# EAGLE design M783 (EAGLE 6.6.0)
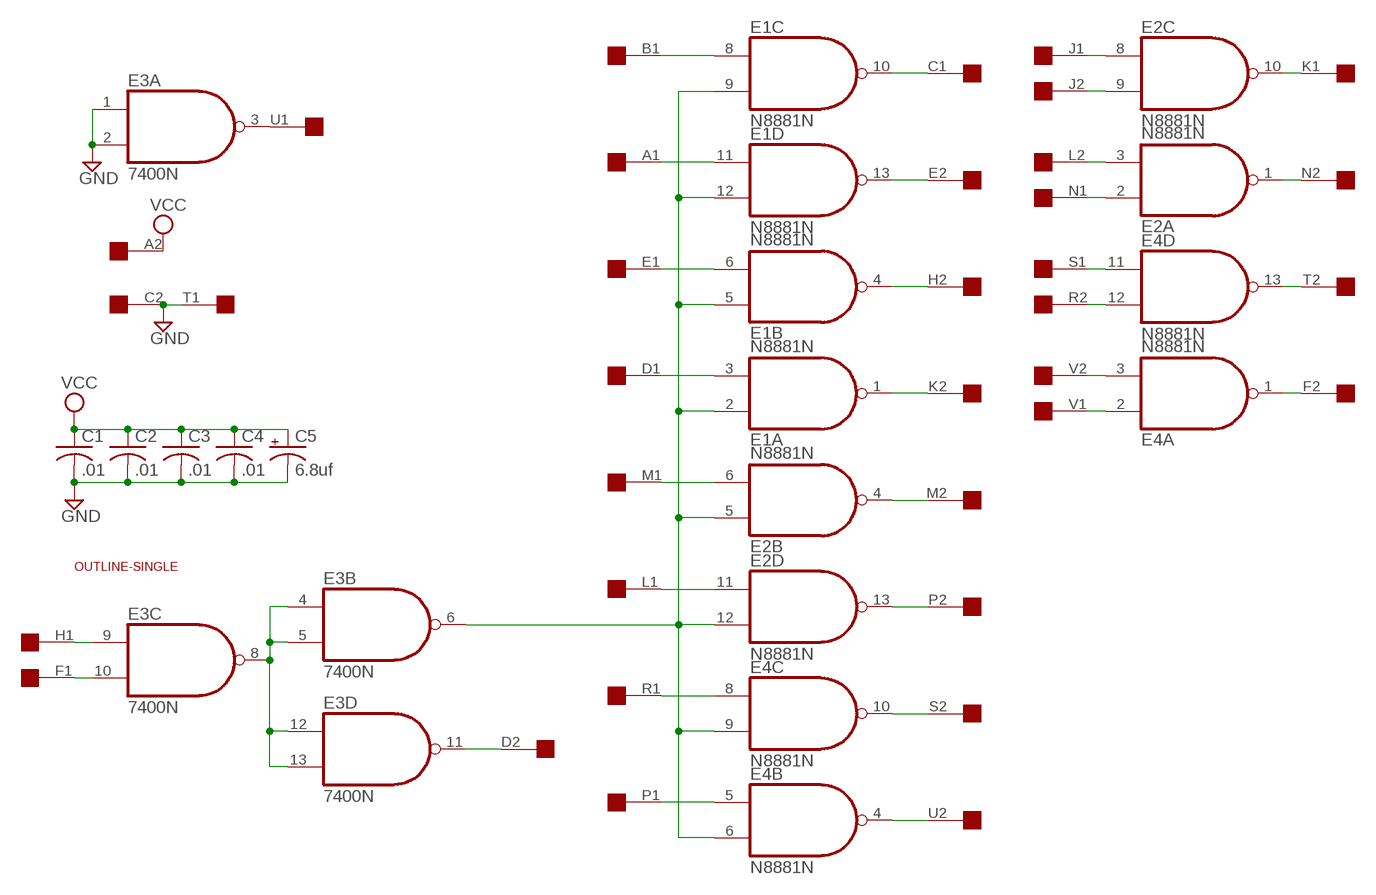
[diagram p0: schematic, sheet 1]

## Parts
C1  .01  C-US050-025X075  [C050-025X075]
C2  .01  C-US050-025X075  [C050-025X075]
C3  .01  C-US050-025X075  [C050-025X075]
C4  .01  C-US050-025X075  [C050-025X075]
C5  6.8uf  CPOL-USE15-5AXIAL  [E15-5]
E1  N8881N  [DIL14]
E2  N8881N  [DIL14]
E3  7400N  [DIL14]
E4  N8881N  [DIL14]
U$1  SINGLE  [EDGE-CON2]
U$2  OUTLINE-SINGLE  [SINGLE]

## Nets
GND: C1.2 C2.2 C3.2 C4.2 C5.- E3.1(A:I0) E3.2(A:I1) U$1.C2 U$1.T1
N$1: E3.3(A:O) U$1.U1
N$2: E1.2(A:I0) E1.5(B:I0) E1.9(C:I1) E1.12(D:I1) E2.5(B:I0) E2.12(D:I1) E3.6(B:O) E4.6(B:I1) E4.9(C:I1)
N$3: E2.4(B:O) U$1.M2
N$4: E2.13(D:O) U$1.P2
N$5: E4.5(B:I0) U$1.P1
N$6: E4.8(C:I0) U$1.R1
N$7: E4.10(C:O) U$1.S2
N$8: E2.11(D:I0) U$1.L1
N$9: E4.4(B:O) U$1.U2
N$10: E2.6(B:I1) U$1.M1
N$11: E1.10(C:O) U$1.C1
N$12: E1.8(C:I0) U$1.B1
N$13: E1.13(D:O) U$1.E2
N$14: E1.11(D:I0) U$1.A1
N$15: E1.4(B:O) U$1.H2
N$16: E1.6(B:I1) U$1.E1
N$17: E1.1(A:O) U$1.K2
N$18: E1.3(A:I1) U$1.D1
N$19: E3.11(D:O) U$1.D2
N$20: E4.1(A:O) U$1.F2
N$21: E4.13(D:O) U$1.T2
N$22: E2.1(A:O) U$1.N2
N$23: E2.10(C:O) U$1.K1
N$24: E2.8(C:I0) U$1.J1
N$25: E2.9(C:I1) U$1.J2
N$26: E2.3(A:I1) U$1.L2
N$27: E2.2(A:I0) U$1.N1
N$28: E4.11(D:I0) U$1.S1
N$29: E4.12(D:I1) U$1.R2
N$30: E3.4(B:I0) E3.5(B:I1) E3.8(C:O) E3.12(D:I0) E3.13(D:I1)
N$31: E3.9(C:I0) U$1.H1
N$32: E3.10(C:I1) U$1.F1
N$33: E4.3(A:I1) U$1.V2
N$34: E4.2(A:I0) U$1.V1
VCC: C1.1 C2.1 C3.1 C4.1 C5.+ U$1.A2
Unconnected: U$1.B2

## Power pins joined to a net without a drawn wire
GND: E1.7(P:GND) E2.7(P:GND) E3.7(P:GND) E4.7(P:GND)
VCC: E1.14(P:VCC) E2.14(P:VCC) E3.14(P:VCC) E4.14(P:VCC)

## Library data of the parts
C1-C4 = rcl:C-US: CAPACITOR, American symbol
C5 = rcl:CPOL-US: POLARIZED CAPACITOR, American symbol
E1 E2 E4 = dec-con:N8881: Quad 2-input NAND gate, open collector
E3 = 74xx-us:74*00: Quad 2-input NAND gate
U$1 = dec-con:SINGLE: Single-Height DEC board
U$2 = dec-con:OUTLINE-*: Board outlines for DEC boards.

## Board
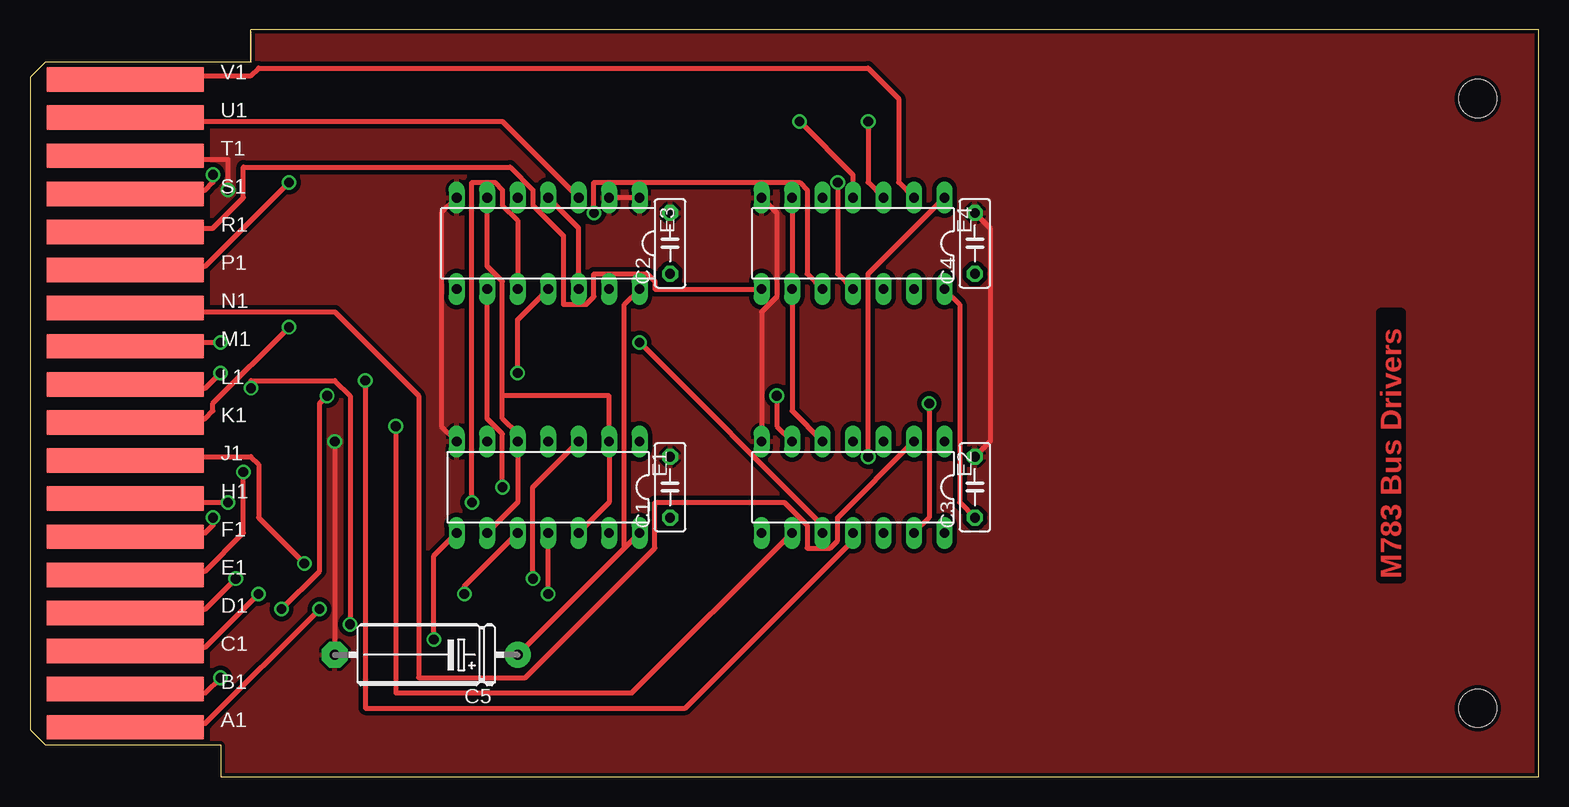
[diagram p1: board, top side]
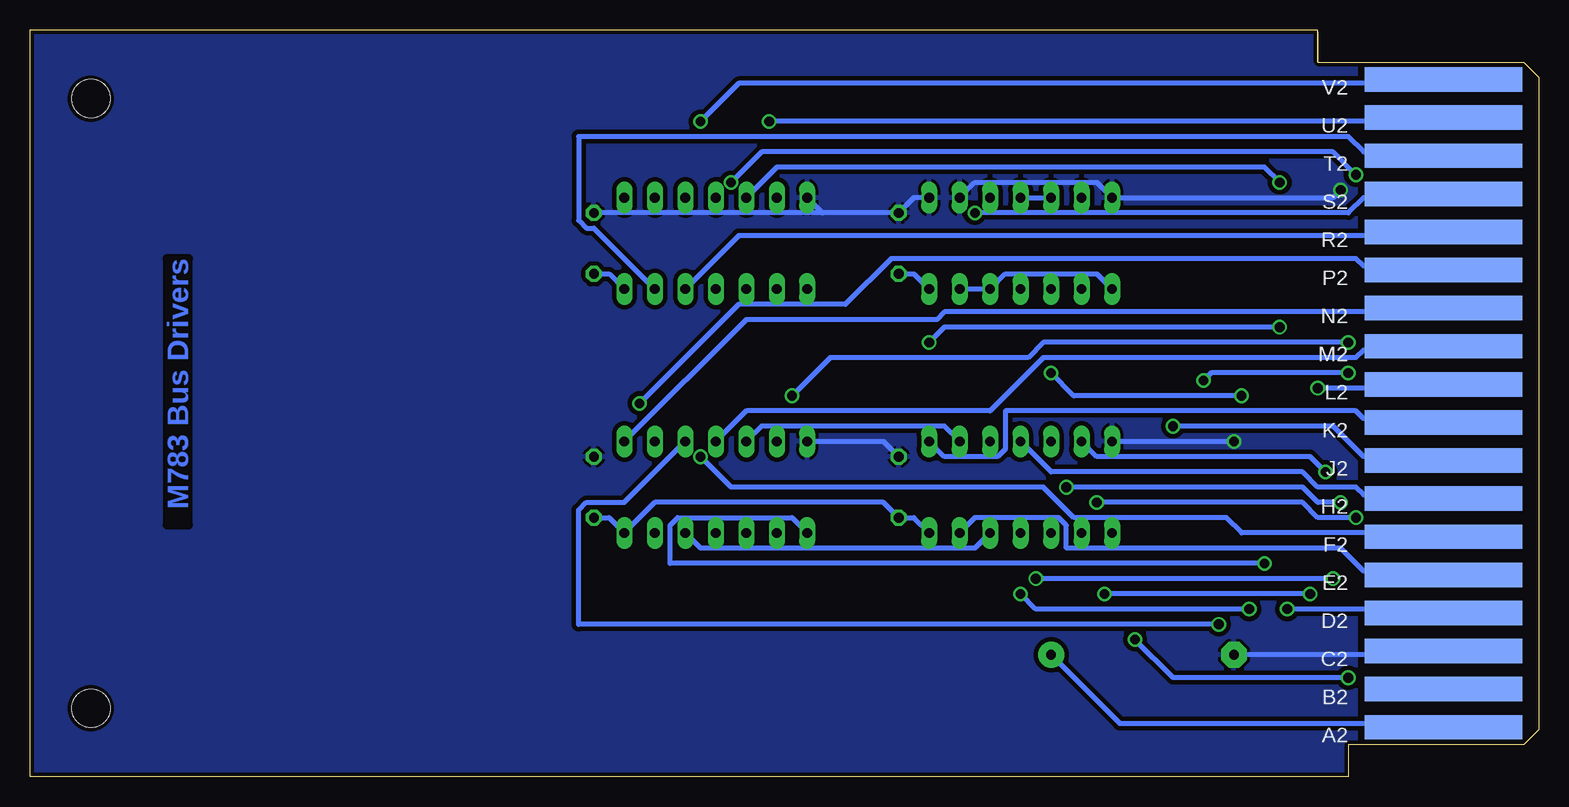
[diagram p2: board, bottom side, seen from below]

Size 125.73 x 62.23 mm. Coordinates in mm from the lower left corner, seen from the top.
Copper layers (1+16): Top 0.035mm / dielectric 1.5mm / Bottom 0.035mm
Design rules "16mils": minimum track width 16mil, minimum drill 32mil, track to track 15mil, track to pad 10mil, pad to pad 10mil, via to via 10mil, smd to smd 10mil, copper to edge 13mil, drill to drill 10mil, minimum pad ring 10mil, minimum via ring 8mil, stop-mask expansion 0mil, vias tented up to drill 0mil, thermal gap 10mil

### Footprints (pad centres in the part's own frame; a part is rotated, then mirrored left to right if it is on the bottom)
C050-025X075 = drill 0.813 octagon: 1 -2.54,0; 2 2.54,0
E15-5 = drill 0.813 pad 2.159: + -7.62,0 | drill 0.813 pad 2.159 octagon: - 7.62,0
DIL14 = drill 0.813 long: 1 -7.62,-3.81; 2 -5.08,-3.81; 3 -2.54,-3.81; 4 0,-3.81; 5 2.54,-3.81; 6 5.08,-3.81; 7 7.62,-3.81; 8 7.62,3.81; 9 5.08,3.81; 10 2.54,3.81; 11 0,3.81; 12 -2.54,3.81; 13 -5.08,3.81; 14 -7.62,3.81
EDGE-CON2 = smd 13.106 x 2.032: A1 7.938,4.128; B1 7.938,7.303; C1 7.938,10.477; D1 7.938,13.652; E1 7.938,16.828; F1 7.938,20.003; H1 7.938,23.177; J1 7.938,26.352; K1 7.938,29.527; L1 7.938,32.703; M1 7.938,35.877; N1 7.938,39.053; P1 7.938,42.227; R1 7.938,45.403; S1 7.938,48.578; T1 7.938,51.752; U1 7.938,54.928; V1 7.938,58.102 | smd 13.106 x 2.032 bottom: A2 7.938,4.128; B2 7.938,7.303; C2 7.938,10.477; D2 7.938,13.652; E2 7.938,16.828; F2 7.938,20.003; H2 7.938,23.177; J2 7.938,26.352; K2 7.938,29.527; L2 7.938,32.703; M2 7.938,35.877; N2 7.938,39.053; P2 7.938,42.227; R2 7.938,45.403; S2 7.938,48.578; T2 7.938,51.752; U2 7.938,54.928; V2 7.938,58.102
SINGLE = hole 3.175: 120.65,56.515; 120.65,5.715

### Placement (x,y rotation side)
C1  53.34,24.13 90 top
C2  53.34,44.45 90 top
C3  78.74,24.13 90 top
C4  78.74,44.45 90 top
C5  33.02,10.16 180 top
E1  43.18,24.13 180 top
E2  68.58,24.13 180 top
E3  43.18,44.45 180 top
E4  68.58,44.45 180 top
U$1  0,0 0 top
U$2  0,0 0 top

### Tracks (layer width: path | path; a pad name or v marks a point on that pad's centre or on a via)
GND  (via drill 0.81)
  Top 0.406: E1.7 34.29,29.21 34.29,46.99 E3.7 | C3.2 80.01,27.94 80.01,45.72 C4.2 | E3.1 E3.2 | E2.7 60.96,38.73 62.23,40.01 62.23,46.99 E4.7 | v16.51,48.9 16.51,51.44 8.26,51.44 U$1.T1 | v25.4,27.94 C5.-
  Bottom 0.406: C5.- 8.26,10.16 U$1.C2 | C1.2 54.61,27.94 E2.7 | E3.1 52.07,48.26 C2.2 59.69,46.99 | 59.69,46.99 E4.7 | 59.69,46.99 C4.2 | E3.2 46.99,49.53 36.83,49.53 E3.7 17.15,48.26 v16.51,48.9 | E1.7 v25.4,27.94
  pour Top (isolate 0.305): 15.24,62.23 125.73,62.23 125.73,0 15.24,0
  pour Bottom (isolate 0.305): 15.24,62.23 125.73,62.23 125.73,0 15.24,0
N$1
  Top 0.406: E3.3 39.37,54.61 8.26,54.61 U$1.U1
N$2
  Top 0.406: E1.9 40.64,22.86 E1.5 40.64,28.57 39.37,29.84 39.37,31.75 | E3.6 38.1,42.55 39.37,41.27 39.37,31.75 | E4.6 E4.9 63.5,30.48 E2.5 | E1.12 48.26,22.86 E1.2 48.26,31.75 39.37,31.75
  Bottom 0.406: E2.12 69.85,19.05 46.99,19.05 E1.12 | E2.5 64.77,29.21 49.53,29.21 E1.2
N$3
  Bottom 0.406: E2.4 66.04,30.48 45.72,30.48 41.28,34.92 15.24,34.92 14.61,35.56 8.26,35.56 U$1.M2
N$4  (via drill 0.81)
  Top 0.406: E2.13 74.93,21.59 v74.93,31.11
  Bottom 0.406: v74.93,31.11 66.68,39.37 57.79,39.37 53.98,43.18 15.24,43.18 14.61,42.55 8.26,42.55 U$1.P2
N$5  (via drill 0.81)
  Top 0.406: v21.59,49.53 14.61,42.55 8.26,42.55 U$1.P1
  Bottom 0.406: E4.5 63.5,50.8 22.86,50.8 v21.59,49.53
N$6
  Top 0.406: E4.8 52.07,40.64 52.07,41.27 51.44,41.91 46.99,41.91 46.99,40.01 46.36,39.37 44.45,39.37 44.45,45.09 41.91,47.62 41.91,48.9 40.01,50.8 17.78,50.8 17.78,48.26 15.24,45.72 8.26,45.72 U$1.R1
N$7  (via drill 0.81)
  Top 0.406: E4.10 64.77,41.91 64.77,48.9 64.14,49.53 46.99,49.53 v46.99,46.99
  Bottom 0.406: v46.99,46.99 15.88,46.99 14.61,48.26 8.26,48.26 U$1.S2
N$8  (via drill 0.81)
  Top 0.406: E2.11 68.58,19.68 54.61,5.71 27.94,5.71 v27.94,33.02 | v15.88,33.66 14.61,32.38 8.26,32.38 U$1.L1
  Bottom 0.406: v27.94,33.02 27.31,33.66 v15.88,33.66
N$9  (via drill 0.81)
  Top 0.406: E4.4 68.58,50.16 v64.14,54.61
  Bottom 0.406: v64.14,54.61 8.26,54.61 U$1.U2
N$10  (via drill 0.81)
  Top 0.406: E2.6 62.23,29.21 v62.23,31.75 | v15.88,36.2 8.26,36.2 U$1.M1
  Bottom 0.406: v62.23,31.75 59.06,34.92 42.55,34.92 41.28,36.2 v15.88,36.2
N$11  (via drill 0.81)
  Top 0.406: E1.10 36.2,15.88 v36.2,15.24 | v19.05,15.24 14.61,10.79 8.26,10.79 U$1.C1
  Bottom 0.406: v19.05,15.24 v36.2,15.24
N$12  (via drill 0.81)
  Top 0.406: E1.8 33.66,18.41 v33.66,11.43 | v15.88,8.26 14.61,6.99 8.26,6.99 U$1.B1
  Bottom 0.406: v33.66,11.43 30.48,8.26 v15.88,8.26
N$13
  Bottom 0.406: E1.13 46.99,21.59 40.01,21.59 39.37,20.95 39.37,19.05 16.51,19.05 14.61,17.14 8.26,17.14 U$1.E2
N$14  (via drill 0.81)
  Top 0.406: v43.18,15.24 E1.11 | v24.13,13.97 14.61,4.45 8.26,4.45 U$1.A1
  Bottom 0.406: v43.18,15.24 41.91,13.97 v24.13,13.97
N$15
  Bottom 0.406: E1.4 40.64,25.4 19.69,25.4 18.42,24.13 15.24,24.13 14.61,23.5 8.26,23.5 U$1.H2
N$16  (via drill 0.81)
  Top 0.406: v17.78,25.4 17.78,20.32 14.61,17.14 8.26,17.14 U$1.E1
  Bottom 0.406: E1.6 36.83,26.67 19.05,26.67 v17.78,25.4
N$17
  Bottom 0.406: E1.1 49.53,26.67 45.09,26.67 44.45,27.3 44.45,30.48 15.24,30.48 14.61,29.84 8.26,29.84 U$1.K2
N$18  (via drill 0.81)
  Top 0.406: E1.3 41.91,24.13 v41.91,16.51 | v17.15,16.51 14.61,13.97 8.26,13.97 U$1.D1
  Bottom 0.406: v17.15,16.51 v41.91,16.51
N$19  (via drill 0.81)
  Top 0.406: E3.11 40.64,38.1 v40.64,33.66 | v24.77,31.75 24.13,31.11 24.13,17.14 v20.96,13.97
  Bottom 0.406: v40.64,33.66 38.74,31.75 v24.77,31.75 | v20.96,13.97 8.26,13.97 U$1.D2
N$20  (via drill 0.81)
  Top 0.406: E4.1 69.85,41.91 v69.85,26.67
  Bottom 0.406: v69.85,26.67 67.31,24.13 41.28,24.13 38.74,21.59 26.04,21.59 24.77,20.32 8.26,20.32 U$1.F2
N$21
  Bottom 0.406: E4.13 78.74,45.72 79.38,45.72 80.01,46.35 80.01,53.34 15.88,53.34 14.61,52.07 8.26,52.07 U$1.T2
N$22
  Bottom 0.406: E2.1 66.04,38.1 50.17,38.1 49.53,38.73 8.26,38.73 U$1.N2
N$23  (via drill 0.81)
  Top 0.406: E2.10 66.04,20.95 v50.8,36.2 | v21.59,37.47 15.24,31.11 15.24,30.48 14.61,29.84 8.26,29.84 U$1.K1
  Bottom 0.406: v50.8,36.2 49.53,37.47 v21.59,37.47
N$24  (via drill 0.81)
  Top 0.406: v22.86,17.78 19.05,21.59 19.05,26.04 18.42,26.67 8.26,26.67 U$1.J1
  Bottom 0.406: E2.8 62.23,21.59 71.76,21.59 72.39,20.95 72.39,17.78 v22.86,17.78
N$25  (via drill 0.81)
  Top 0.406: E2.9 50.17,6.99 30.48,6.99 v30.48,29.21
  Bottom 0.406: v30.48,29.21 17.15,29.21 14.61,26.67 8.26,26.67 U$1.J2
N$26  (via drill 0.81)
  Top 0.406: v26.67,12.7 26.67,31.75 25.4,33.02 18.42,33.02 v18.42,32.38
  Bottom 0.406: E2.3 76.2,22.86 79.38,22.86 80.01,22.23 80.01,12.7 v26.67,12.7 | v18.42,32.38 8.26,32.38 U$1.L2
N$27
  Top 0.406: E2.2 67.31,21.59 67.31,19.68 66.68,19.05 64.77,19.05 64.77,20.95 62.87,22.86 52.07,22.86 52.07,19.05 41.28,8.26 32.39,8.26 32.39,31.75 25.4,38.73 8.26,38.73 U$1.N1
N$28  (via drill 0.81)
  Top 0.406: E4.11 67.31,41.91 v67.31,49.53 | v15.24,50.16 15.24,49.53 14.61,48.9 8.26,48.9 U$1.S1
  Bottom 0.406: v67.31,49.53 64.77,52.07 17.15,52.07 v15.24,50.16
N$29
  Bottom 0.406: E4.12 66.68,45.09 8.26,45.09 U$1.R2
N$30
  Top 0.406: E3.4 45.72,45.72 E3.12
  Bottom 0.406: E3.4 E3.5 | E3.8 36.83,41.91 44.45,41.91 E3.12 E3.13
N$31  (via drill 0.81)
  Top 0.406: E3.9 38.1,29.84 39.37,28.57 v39.37,24.13 | v16.51,22.86 8.26,22.86 U$1.H1
  Bottom 0.406: v39.37,24.13 19.69,24.13 18.42,22.86 v16.51,22.86
N$32  (via drill 0.81)
  Top 0.406: E3.10 40.64,46.35 39.37,47.62 39.37,48.9 38.74,49.53 36.83,49.53 v36.83,22.86 | v15.24,21.59 15.24,20.95 14.61,20.32 8.26,20.32 U$1.F1
  Bottom 0.406: v36.83,22.86 19.69,22.86 18.42,21.59 v15.24,21.59
N$33  (via drill 0.81)
  Top 0.406: E4.3 69.85,49.53 v69.85,54.61
  Bottom 0.406: v69.85,54.61 66.68,57.78 8.26,57.78 U$1.V2
N$34
  Top 0.406: E4.2 72.39,49.53 72.39,56.52 69.85,59.05 19.05,59.05 18.42,58.42 8.26,58.42 U$1.V1
VCC
  Top 0.406: C3.1 77.47,22.86 77.47,39.37 E4.14 | C5.+ 49.53,19.05 | 49.53,19.05 E1.14 | E3.14 49.53,39.37 49.53,19.05
  Bottom 0.406: C3.1 77.47,21.59 E2.14 73.66,22.86 54.61,22.86 C1.1 52.07,21.59 E1.14 | E4.14 77.47,41.91 C4.1 | E3.14 52.07,41.91 C2.1 | C5.+ 34.93,4.45 8.26,4.45 U$1.A2

### Text on the board
Top: M783 Bus Drivers
Bottom: M783 Bus Drivers